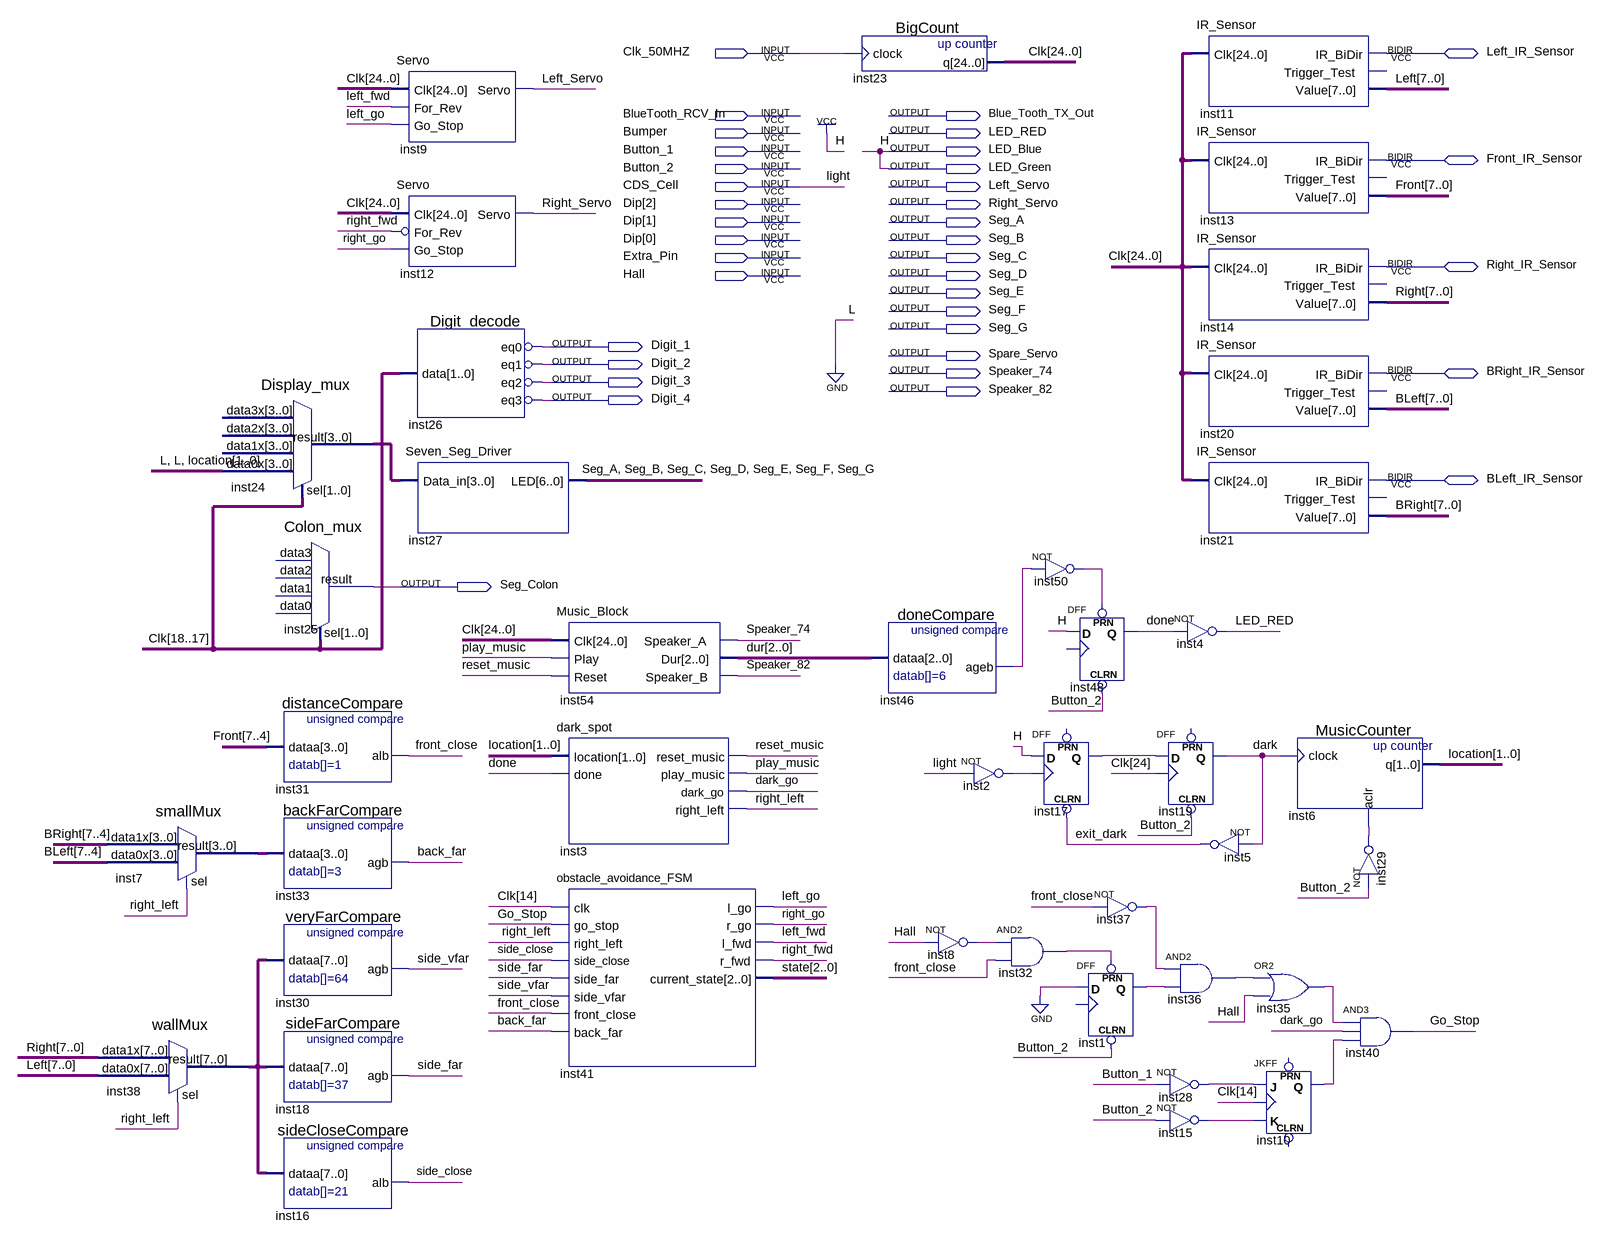
[diagram p0: schematic sheet]
// Quartus schematic robotmain.bdf as structural Verilog: 42 symbols, 37 pins
module robotmain (
  input  Clk_50MHZ,
  input  BlueTooth_RCV_In,
  input  Bumper,
  input  Button_1,
  input  Button_2,
  input  CDS_Cell,
  input  [2:0] Dip,
  input  Extra_Pin,
  input  Hall,
  inout  Left_IR_Sensor,
  inout  Front_IR_Sensor,
  inout  Right_IR_Sensor,
  inout  BRight_IR_Sensor,
  inout  BLeft_IR_Sensor,
  output Blue_Tooth_TX_Out,
  output LED_RED,
  output LED_Blue,
  output LED_Green,
  output Left_Servo,
  output Right_Servo,
  output Seg_A,
  output Seg_B,
  output Seg_C,
  output Seg_D,
  output Seg_E,
  output Seg_F,
  output Seg_G,
  output Digit_1,
  output Spare_Servo,
  output Digit_2,
  output Speaker_74,
  output Digit_3,
  output Speaker_82,
  output Digit_4,
  output Seg_Colon
);

  wire back_far, dark, dark_go, done, exit_dark, front_close, Go_Stop, inst1_q, inst2_out, inst8_out,
       inst10_q, inst15_out, inst17_q, inst26_eq0, inst26_eq1, inst26_eq2, inst26_eq3, inst28_out,
       inst29_out, inst32_out, inst35_out, inst36_out, inst37_out, inst46_ageb, inst50_out, left_fwd,
       left_go, play_music, reset_music, right_fwd, right_go, right_left, side_close, side_far, side_vfar;
  wire [1:0] location;
  wire [2:0] dur, state;
  wire [3:0] inst7_result, inst24_result;
  wire [7:0] BLeft, BRight, Front, inst38_result, Left, Right;
  wire [24:0] Clk;

  smallMux inst7 (.data1x(BRight[7:4]), .data0x(BLeft[7:4]), .sel(right_left), .result(inst7_result));
  wallMux inst38 (.data1x(Right), .data0x(Left), .sel(right_left), .result(inst38_result));
  Display_mux inst24 (
    .data0x({2'b00, location}), .sel(Clk[18:17]), .result(inst24_result));  // open: data3x, data2x, data1x
  Colon_mux inst25 (.sel(Clk[18:17]), .result(Seg_Colon));  // open: data3, data2, data1, data0
  distanceCompare inst31 (.dataa(Front[7:4]), .alb(front_close));
  backFarCompare inst33 (.dataa(inst7_result), .agb(back_far));
  veryFarCompare inst30 (.dataa(inst38_result), .agb(side_vfar));
  sideFarCompare inst18 (.dataa(inst38_result), .agb(side_far));
  sideCloseCompare inst16 (.dataa(inst38_result), .alb(side_close));
  Servo inst9 (.Clk(Clk), .For_Rev(left_fwd), .Go_Stop(left_go), .Servo(Left_Servo));
  Servo inst12 (.Clk(Clk), .For_Rev(~right_fwd), .Go_Stop(right_go), .Servo(Right_Servo));
  Digit_decode inst26 (.data(Clk[18:17]), .eq0(inst26_eq0), .eq1(inst26_eq1), .eq2(inst26_eq2), .eq3(inst26_eq3));
  not inst26_eq0_inverted (Digit_1, inst26_eq0);
  not inst26_eq1_inverted (Digit_2, inst26_eq1);
  not inst26_eq2_inverted (Digit_3, inst26_eq2);
  not inst26_eq3_inverted (Digit_4, inst26_eq3);
  Seven_Seg_Driver inst27 (.Data_in(inst24_result), .LED({Seg_A, Seg_B, Seg_C, Seg_D, Seg_E, Seg_F, Seg_G}));
  Music_Block inst54 (
    .Clk(Clk), .Play(play_music), .Reset(reset_music), .Speaker_A(Speaker_74), .Dur(dur),
    .Speaker_B(Speaker_82));
  dark_spot inst3 (
    .location(location), .done(done), .reset_music(reset_music), .play_music(play_music), .dark_go(dark_go),
    .right_left(right_left));
  obstacle_avoidance_FSM inst41 (
    .clk(Clk[14]), .go_stop(Go_Stop), .right_left(right_left), .side_close(side_close), .side_far(side_far),
    .side_vfar(side_vfar), .front_close(front_close), .back_far(back_far), .l_go(left_go), .r_go(right_go),
    .l_fwd(left_fwd), .r_fwd(right_fwd), .current_state(state));
  BigCount inst23 (.clock(Clk_50MHZ), .q(Clk));
  doneCompare inst46 (.dataa(dur), .ageb(inst46_ageb));
  not inst2 (inst2_out, CDS_Cell);
  not inst8 (inst8_out, Hall);
  not inst50 (inst50_out, inst46_ageb);
  DFF inst17 (.CLRN(exit_dark), .CLK(inst2_out), .D(1'b1), .Q(inst17_q));  // open: PRN
  and inst32 (inst32_out, inst8_out, front_close);
  DFF inst48 (.CLRN(Button_2), .D(1'b1), .PRN(inst50_out), .Q(done));  // open: CLK
  not inst37 (inst37_out, front_close);
  DFF inst1 (.CLRN(Button_2), .D(1'b0), .PRN(inst32_out), .Q(inst1_q));  // open: CLK
  not inst4 (LED_RED, done);
  DFF inst19 (.CLRN(Button_2), .CLK(Clk[24]), .D(inst17_q), .Q(dark));  // open: PRN
  and inst36 (inst36_out, inst37_out, inst1_q);
  not inst28 (inst28_out, Button_1);
  not inst15 (inst15_out, Button_2);
  IR_Sensor inst11 (.Clk(Clk), .Value(Left), .IR_BiDir(Left_IR_Sensor));  // open: Trigger_Test
  IR_Sensor inst13 (.Clk(Clk), .Value(Front), .IR_BiDir(Front_IR_Sensor));  // open: Trigger_Test
  IR_Sensor inst14 (.Clk(Clk), .Value(Right), .IR_BiDir(Right_IR_Sensor));  // open: Trigger_Test
  IR_Sensor inst20 (.Clk(Clk), .Value(BLeft), .IR_BiDir(BRight_IR_Sensor));  // open: Trigger_Test
  IR_Sensor inst21 (.Clk(Clk), .Value(BRight), .IR_BiDir(BLeft_IR_Sensor));  // open: Trigger_Test
  not inst5 (exit_dark, dark);
  or inst35 (inst35_out, inst36_out, Hall);
  JKFF inst10 (.K(inst15_out), .J(inst28_out), .CLK(Clk[14]), .Q(inst10_q));  // open: PRN, CLRN
  MusicCounter inst6 (.clock(dark), .aclr(inst29_out), .q(location));
  not inst29 (inst29_out, Button_2);
  and inst40 (Go_Stop, inst35_out, dark_go, inst10_q);

  assign LED_Blue = 1'b1;
  assign LED_Green = 1'b1;

  // Other names for the same wires on the sheet: light = CDS_Cell
endmodule
